# EAGLE design sega_genesis (EAGLE 7.7.0)
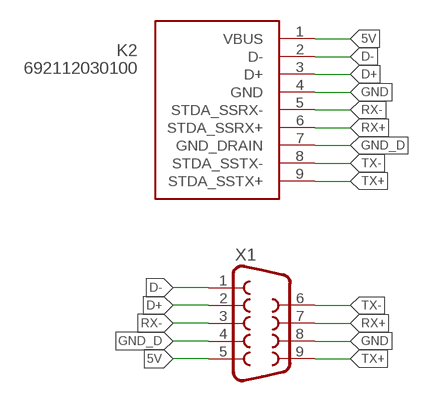
[diagram p0: schematic, sheet 1]

## Parts
K2  692112030100  [692112030100]
X1  DB9MALE  [DB9_MALE]

## Nets
5V: K2.1(VBUS) X1.5
D+: K2.3(D+) X1.2
D-: K2.2(D-) X1.1
GND: K2.4(GND) X1.8
GND_D: K2.7(GND_DRAIN) X1.4
RX+: K2.6(STDA_SSRX+) X1.7
RX-: K2.5(STDA_SSRX-) X1.3
TX+: K2.9(STDA_SSTX+) X1.9
TX-: K2.8(STDA_SSTX-) X1.6

## Library data of the parts
K2 = Wuerth_Elektronik_eiCan_Communication_Connectors_STENCIL:692112030100: WR-COM USB 3.0 SMT PLUG WITH CLIPTYPE A
X1 = SparkFun:DB9: DB9 Connector Standard DB9 (D-Sub 9) serial connector. Can be used for CAN bus as well as RS485 and RS232. Footprint production proven. Spark Fun Electronics SKU : PRT-00429

## Board
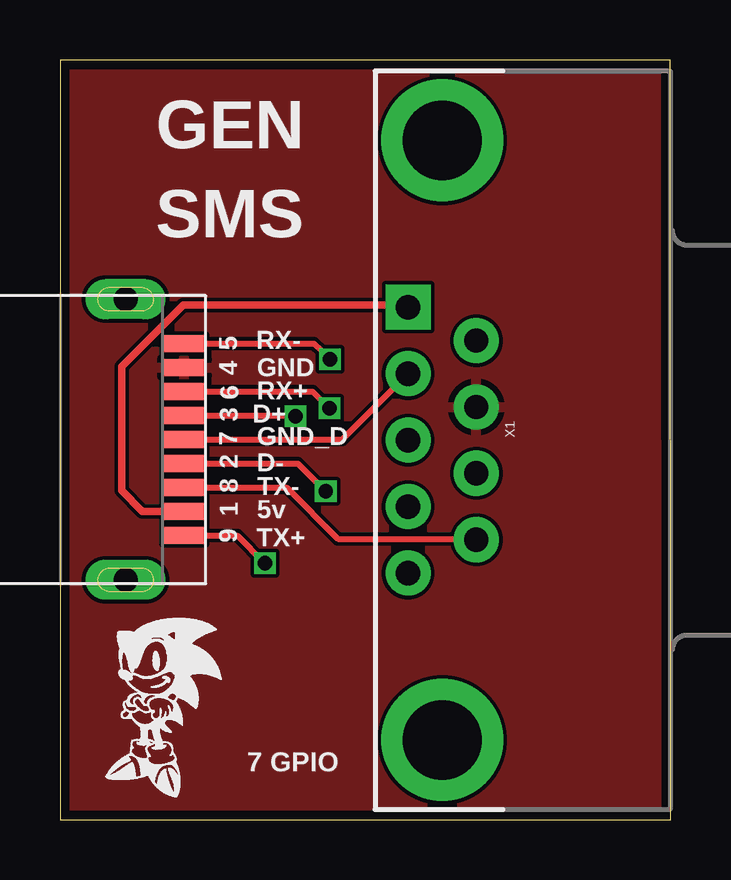
[diagram p1: board, top side]
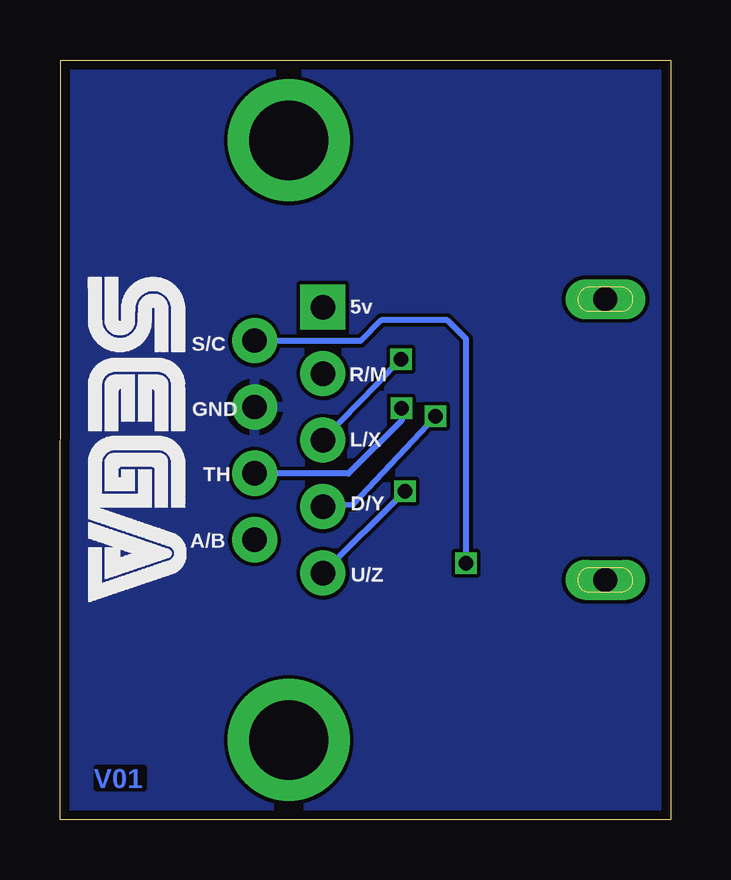
[diagram p2: board, bottom side, seen from below]

Size 25.46 x 31.67 mm. Coordinates in mm from the lower left corner, seen from the top.
Outline: 0,0 25.46,0 25.43,31.67 0,31.67 0,0
Copper layers (1*16): Top 0.035559375mm / dielectric 1.6mm / Bottom 0.035559375mm
Design rules "oshpark-2layer": minimum track width 6mil, minimum drill 10mil, track to track 6mil, track to pad 6mil, pad to pad 6mil, via to via 6mil, smd to smd 6mil, copper to edge 15mil, drill to drill 6mil, minimum pad ring 5mil, minimum via ring 5mil, stop-mask expansion 2.5mil, vias tented up to drill 0mil, thermal gap 10mil

### Footprints (pad centres in the part's own frame; a part is rotated, then mirrored left to right if it is on the bottom)
692112030100 = smd 0.7 x 1.8: 1 -3,0; 2 -1,0; 3 1,0; 4 3,0; 5 4,0; 6 2,0; 7 0,0; 8 -2,0; 9 -4,0 | drill 1 pad 1.676 long: Z1 5.85,2.45; Z2 -5.85,2.45
DB9_MALE = drill 1.016 pad 1.88: 1 5.54,-1.42; 2 2.77,-1.42; 3 0,-1.42; 4 -2.77,-1.42; 6 4.15,1.42; 7 1.38,1.42; 8 -1.38,1.42; 9 -4.15,1.42 | drill 1.016 pad 1.88 square: 5 -5.54,-1.42 | drill 3.302 pad 5.08: G1 -12.5,0; G2 12.5,0

### Placement (x,y rotation side)
K2  5.18,15.85 90 top
X1  15.93,15.82 270 top

### Tracks (layer width: path | path; a pad name or v marks a point on that pad's centre or on a via)
5V
  Top 0.305: K2.1 3.43,12.85 2.57,13.72 2.57,18.9 5.13,21.46 14.41,21.46 X1.5
D+  (via drill 0.6)
  Top 0.254: K2.3 9.77,16.85 v9.8,16.81
  Bottom 0.254: X1.2 13.26,13.13 v9.8,16.81
D-  (via drill 0.6)
  Top 0.254: K2.2 9.92,14.85 v11.07,13.69
  Bottom 0.254: v11.07,13.69 11.1,13.69 X1.1
GND
  pour Bottom: 0.33,31.39 25.3,31.52 25.4,-0.05 0.08,0.13
  pour Top: 0.28,31.47 25.25,31.5 25.3,0.1 0.03,0.2
GND_D
  Top 0.254: K2.7 11.76,15.85 X1.4
RX+  (via drill 0.6)
  Top 0.254: K2.6 10.52,17.85 v11.23,17.14
  Bottom 0.254: X1.7 17.33,14.43 13.44,14.43 11.23,16.64 v11.23,17.14
RX-  (via drill 0.6)
  Top 0.254: K2.5 10.58,19.85 v11.25,19.2
  Bottom 0.254: v11.25,19.2 12.27,18.14 X1.3
TX+  (via drill 0.6)
  Top 0.254: K2.9 7.38,11.85 v8.53,10.69
  Bottom 0.254: v8.53,10.69 8.53,20.04 9.32,20.83 12.07,20.83 12.93,19.96 X1.9
TX-
  Top 0.203: 17.31,11.71 X1.6
  Top 0.254: K2.8 9.44,13.85 11.58,11.71 17.31,11.71

### Text on the board
Bottom: V01
tPlace: GEN | SMS | RX- | 5 | 4 | GND | 6 | RX+ | 7 | 3 | D+ | GND_D | 2 | 8 | D- | 1 | TX- | 5v | 9 | TX+ | 7 GPIO
bPlace: 5v | S/C | R/M | GND | L/X | TH | D/Y | A/B | U/Z